# Altium project xbreak-k.PrjPcb
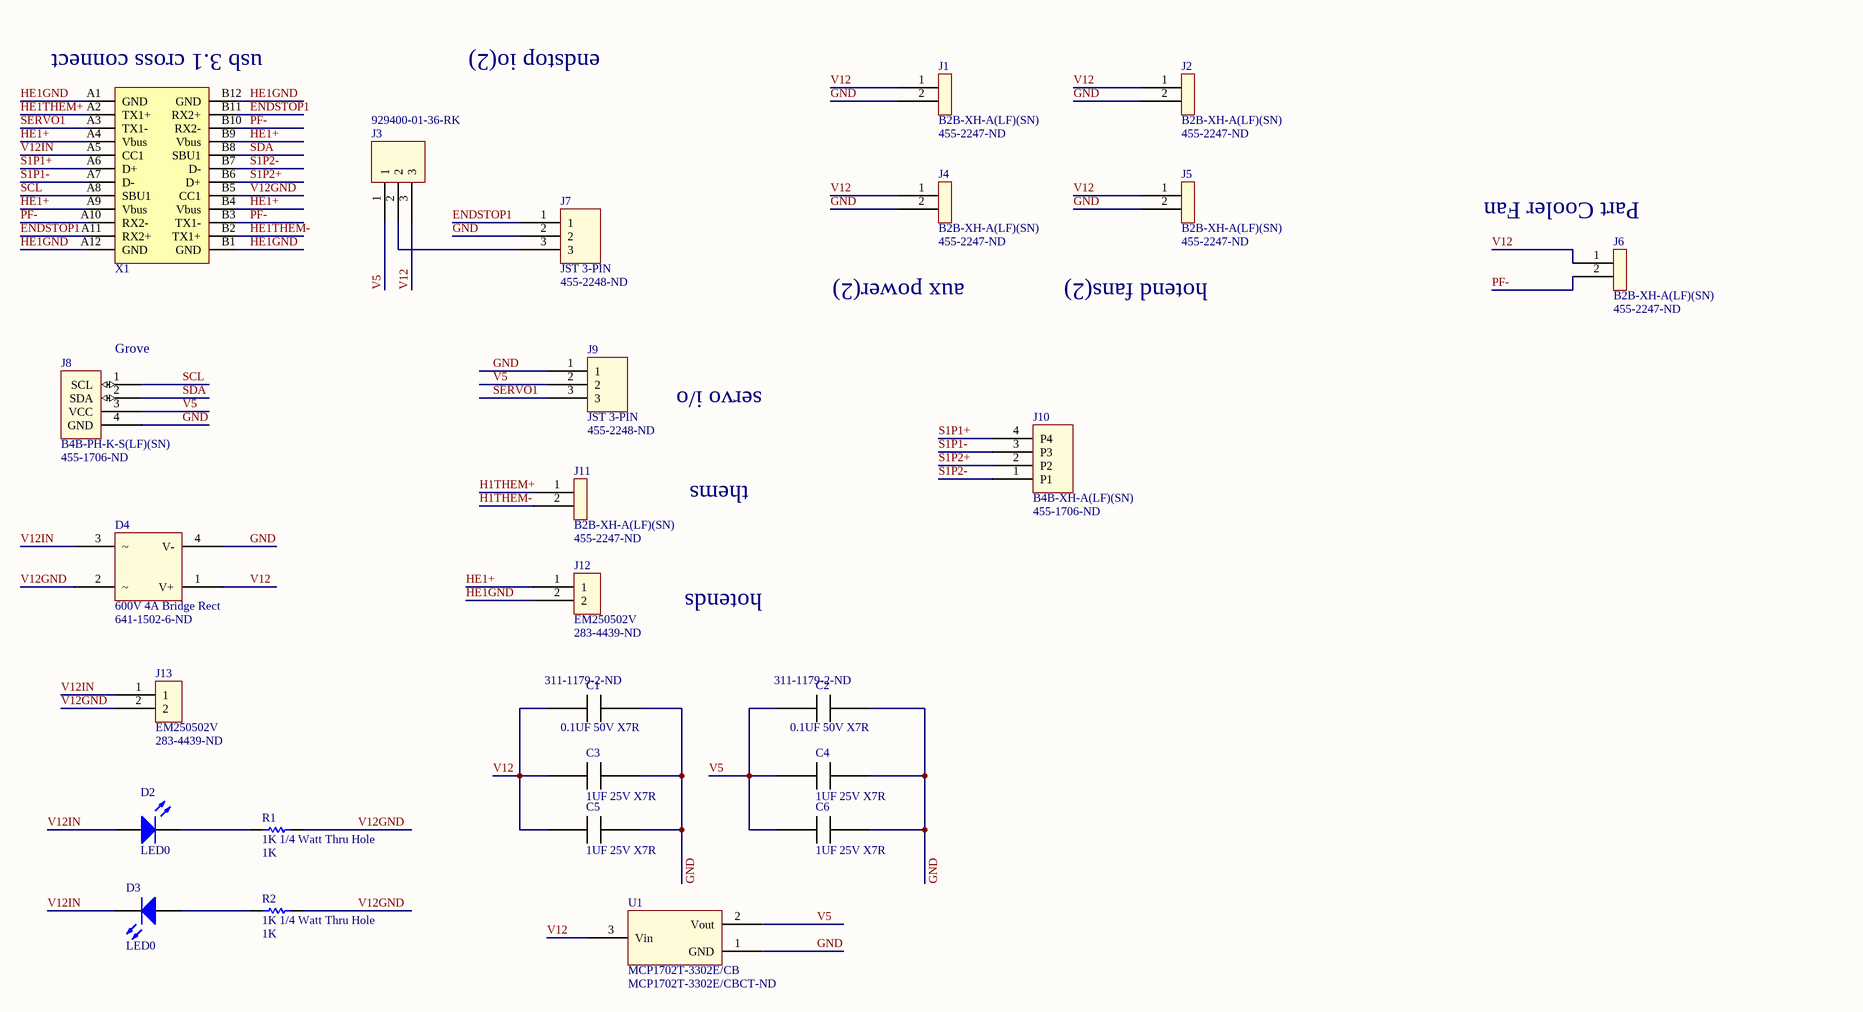
[diagram p0: Sheet1_xbreak-k.SchDoc]
1 sheet, 26 parts. Net scope: global (net labels, ports and power ports of the same name join across sheets).
Board file: xbreak-k.PcbDoc

## Sheet Sheet1_xbreak-k.SchDoc: xBreak Breakout Board
size C; Date: Jan 3, 2015; CompanyName: Neural Cloud Computing Pte Ltd; DrawnBy: Glenn West; Engineer: Glenn West; DocumentNumber: 1210-1; DocumentName: xBreak1; ProjectName: Xbreak1

### Parts
C1  0.1UF 50V X7R  Supplier Part Number 1: 311-1179-2-ND  [C1206YageoX7R]
C2  0.1UF 50V X7R  Supplier Part Number 1: 311-1179-2-ND  [C1206YageoX7R]
C3  1UF 25V X7R  [C1206YageoX7R]
C4  1UF 25V X7R  [C1206YageoX7R]
C5  1UF 25V X7R  [C1206YageoX7R]
C6  1UF 25V X7R  [C1206YageoX7R]
D2  LED0  [LED-0]
D3  LED0  [LED-0]
D4  600V 4A Bridge Rect  Supplier Part Number 1: 641-1502-6-ND  [Z4DGP406L-HF]
J1  B2B-XH-A(LF)(SN)  Supplier Part Number 1: 455-2247-ND  [77311-118-02LF]
J2  B2B-XH-A(LF)(SN)  Supplier Part Number 1: 455-2247-ND  [77311-118-02LF]
J3  929400-01-36-RK  [929400-01-36-RK]
J4  B2B-XH-A(LF)(SN)  Supplier Part Number 1: 455-2247-ND  [77311-118-02LF]
J5  B2B-XH-A(LF)(SN)  Supplier Part Number 1: 455-2247-ND  [77311-118-02LF]
J6  B2B-XH-A(LF)(SN)  Supplier Part Number 1: 455-2247-ND  [77311-118-02LF]
J7  JST 3-PIN  Supplier Part Number 1: 455-2248-ND  [B3B-XH-A(LF)(SN)]
J8  B4B-PH-K-S(LF)(SN)  Supplier Part Number 1: 455-1706-ND  [B4B-PH-K-S(LF)(SN)]
J9  JST 3-PIN  Supplier Part Number 1: 455-2248-ND  [B3B-XH-A(LF)(SN)]
J10  B4B-XH-A(LF)(SN)  Supplier Part Number 1: 455-1706-ND  [B4B-PH-K-S(LF)(SN)]
J11  B2B-XH-A(LF)(SN)  Supplier Part Number 1: 455-2247-ND  [77311-118-02LF]
J12  EM250502V  Supplier Part Number 1: 283-4439-ND  [EM250502V]
J13  EM250502V  Supplier Part Number 1: 283-4439-ND  [EM250502V]
R1  1K 1/4 Watt Thru Hole  value 1K  [AXIAL-0.3]
R2  1K 1/4 Watt Thru Hole  value 1K  [AXIAL-0.3]
U1  MCP1702T-3302E/CB  Supplier Part Number 1: MCP1702T-3302E/CBCT-ND  [MCP1702-SOT-23A]
X1  USB_3_1  [USB_3.1]  (value not drawn)

### Nets
ENDSTOP1: J7.1 X1.A11(RX2+) X1.B11(RX2+)
GND: C1.2 C2.2 C3.2 C4.2 C5.2 C6.2 D4.4(V-) J1.2 J2.2 J4.2 J5.2 J7.2 J8.4(GND) J9.1 U1.1(GND)
H1THEM+: J11.1
H1THEM-: J11.2
HE1+: J12.1 X1.A4(Vbus) X1.A9(Vbus) X1.B4(Vbus) X1.B9(Vbus)
HE1GND: J12.2 X1.A1(GND) X1.A12(GND) X1.B1(GND) X1.B12(GND)
HE1THEM+: X1.A2(TX1+)
HE1THEM-: X1.B2(TX1+)
PF-: J6.2 X1.A10(RX2-) X1.B3(TX1-) X1.B10(RX2-)
S1P1+: J10.4(P4) X1.A6(D+)
S1P1-: J10.3(P3) X1.A7(D-)
S1P2+: J10.2(P2) X1.B6(D+)
S1P2-: J10.1(P1) X1.B7(D-)
SCL: J8.1(SCL) X1.A8(SBU1)
SDA: J8.2(SDA) X1.B8(SBU1)
SERVO1: J9.3 X1.A3(TX1-)
V5: C2.1 C4.1 C6.1 J3.1 J8.3(VCC) J9.2 U1.2(Vout)
V12: C1.1 C3.1 C5.1 D4.1(V+) J1.1 J2.1 J3.3 J4.1 J5.1 J6.1 U1.3(Vin)
V12GND: D4.2 J13.2 R1.2 R2.2 X1.B5(CC1)
V12IN: D2.1(A) D3.2(K) D4.3 J13.1 X1.A5(CC1)
NetD2_2: D2.2(K) R1.1
NetD3_1: D3.1(A) R2.1
NetJ3_2: J3.2 J7.3

### Notes on the sheet
- (near X1) usb 3.1 cross connect
- endstop io(2)
- (near J6) Part Cooler Fan
- aux power(2)
- hotend fans(2)
- (near J8) Grove
- servo i/o
- thems
- hotends

### Library data of the parts
C1 C2 = CC1206KRX7R9BB104: CAP CER 0.1UF 50V X7R 1206 YAGEO CC1206KRX7R9BB104; Supplier 1: Digi-Key
C3-C6 = CC1206KKX7R8BB105: CAP CER 1UF 25V X7R 1206 Yageo CC1206KKX7R8BB105; Supplier 1: Digi-Key; Supplier Part Number 1: 311-1356-2-ND
D2 D3 = LED0: Typical INFRARED GaAs LED; Published: 8-Jun-2000; LatestRevisionDate: 08-Jul-2005; LatestRevisionNote: Mech Layer 1 removed.; PackageReference: LED-0; Publisher: Altium Limited; PackageDescription: LED; 2 Leads
D4 = Z4DGP406L-HF: RECT BRIDGE GP 600V 4A Z4-D ComChip Z4DGP406L-HF; Supplier 1: Digi-Key
J1 J2 J4-J6 J11 = B2B-XH-A(LF)(SN): CONN HEADER XH TOP 2POS 2.5MM  JST B2B-XH-A(LF)(SN); Supplier 1: Digi-Key
J3 = 929400-01-36-RK: 3M 929400-01-36-RK CONN HEADER .100 SNGL STR 36POS - Use 3 Pin; Supplier 1: Digi-Key; Supplier Part Number 1: 929400E-01-36-ND
J7 J9 = B3B-XH-A(LF)(SN): CONN HEADER XH TOP 3POS 2.5MM JST B3B-XH-A(LF)(SN); Supplier 1: Digi-Key
J10 = B4B-XH-A(LF)(SN): CONN HEADER XH TOP 4POS 2.5MM JST B4B-XH-A(LF)(SN); Supplier 1: Digi-Key
J12 J13 = EM250502V: TERM BLOCK 16A 300V 12-26AWG Eaton Bussman EM250502V; Supplier 1: Digi-Key
R1 R2 = Res1: Resistor; Published: 8-Jun-2000; LatestRevisionDate: 17-Jul-2002; LatestRevisionNote: Re-released for DXP Platform.; PackageReference: AXIAL-0.3; Publisher: Altium Limited; PackageDescription: Axial Device, Thru-Hole; 2 Leads; 0.3 in Pin Spacing
U1 = MCP1702: IC REG LDO 3.3V 0.25A SOT23A-3 Microchip MCP1702T-3302E/CB; Supplier 1: Digi-Key
X1 = USB 3.1: USB 3.1 Connector; Manufacturer: Amphenol Commercial Products; Manufacturer Part Number: 12401548E4#2A; Connector Type: USB - C; Number of Contacts: 24; Gender: Receptacle; Specifications: USB 3.1, Superspeed+; Supplier 1: Digi-Key; Supplier Part Number 1: 12401548E4#2ACT-ND; RoHS: RoHS Compliant; Category: Connectors, Interconnects; Stock 1: 5275; Pricing 1: 1=1.87, 10=1.698, 25=1.594, 50=1.5246, 100=1.4553, 250=1.31672 (USD); Packaging: Cut Tape (CT); Mounting Type: Surface Mount, Right Angle; Through Hole; Features: Board Guide; Ingress Protection: -; ComponentLink1URL: https://www.amphenolcanada.com/ProductSearch/drawings/AC/12401548E4#2A.pdf; ComponentLink1Description: https://www.amphenolcanada.com/ProductSearch/drawings/AC/12401548E4#2A.pdf
J8 = B4B-PH-K-S(LF)(SN): Supplier 1: Digi-Key